# EAGLE schematic control_board (EAGLE 9.6.2)

## Sheet 1 of 4: ADC
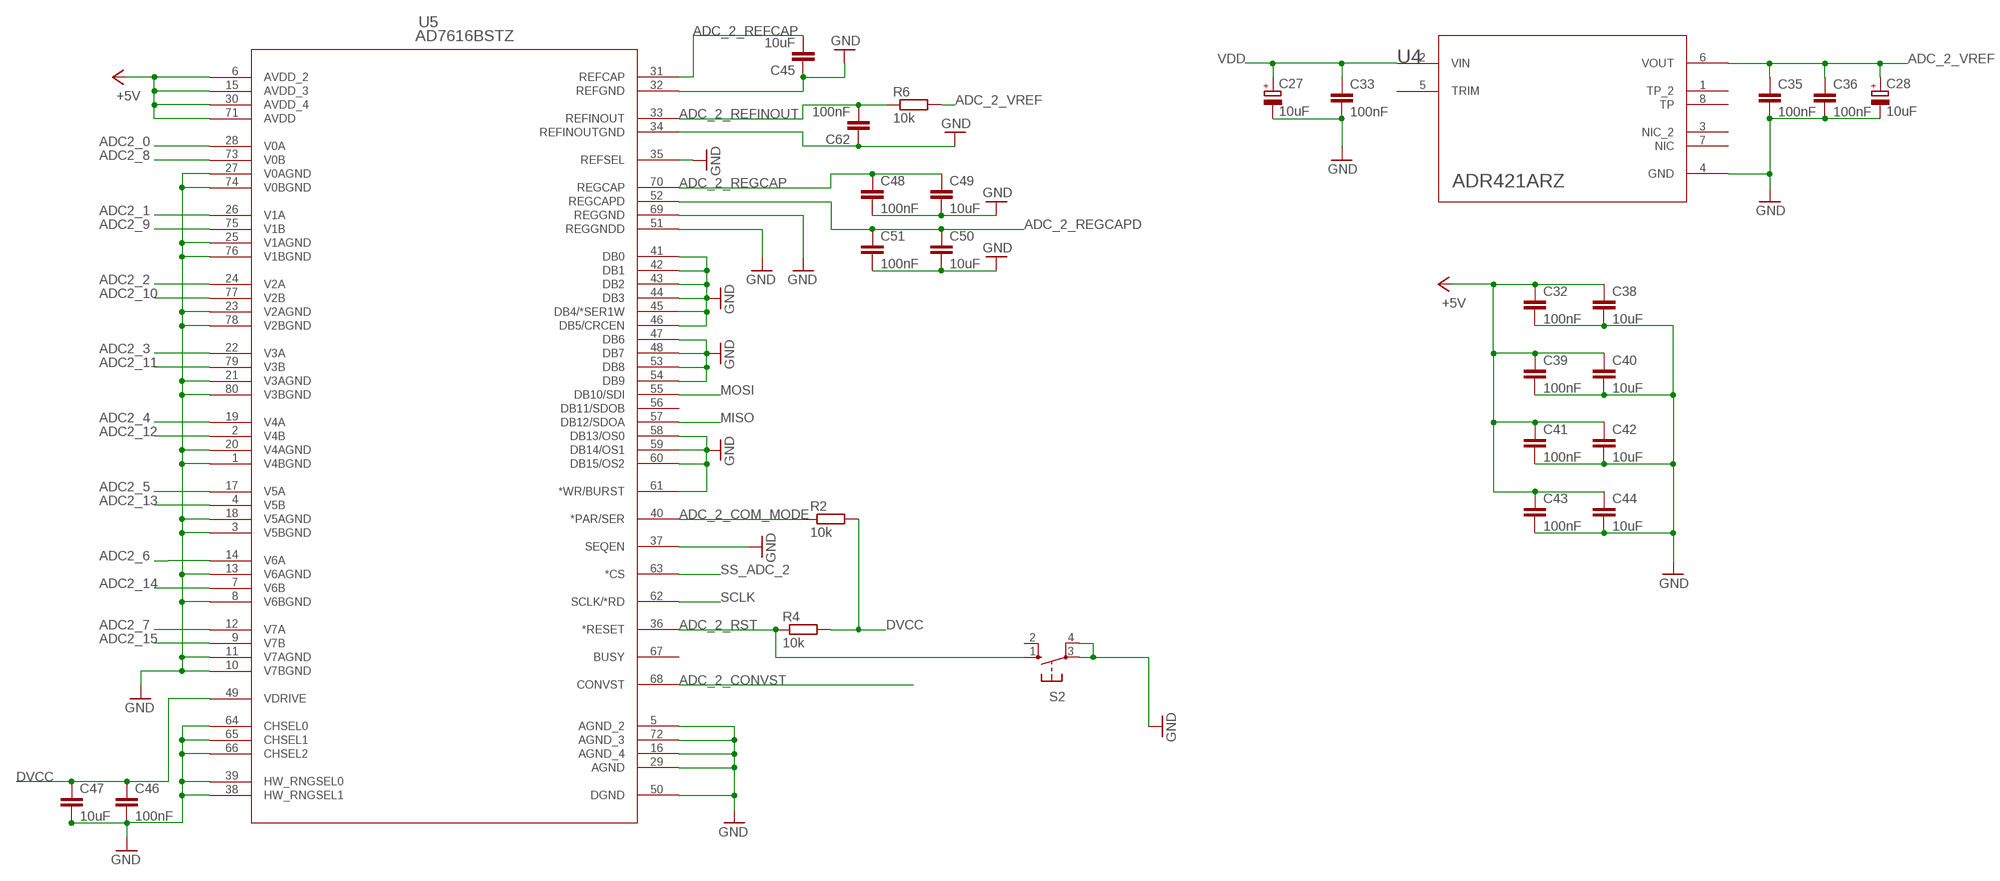
[diagram p0: schematic, sheet 1]

### Parts
C27  10uF  CPOL-EUSMCA  [SMC_A]
C28  10uF  CPOL-EUSMCA  [SMC_A]
C32  100nF  C-EUC0603  [C0603]
C33  100nF  C-EUC0603  [C0603]
C35  100nF  C-EUC0603  [C0603]
C36  100nF  C-EUC0603  [C0603]
C38  10uF  C-EUC0603  [C0603]
C39  100nF  C-EUC0603  [C0603]
C40  10uF  C-EUC0603  [C0603]
C41  100nF  C-EUC0603  [C0603]
C42  10uF  C-EUC0603  [C0603]
C43  100nF  C-EUC0603  [C0603]
C44  10uF  C-EUC0603  [C0603]
C45  10uF  C-EUC0603  [C0603]
C46  100nF  C-EUC0603  [C0603]
C47  10uF  C-EUC0603  [C0603]
C48  100nF  C-EUC0603  [C0603]
C49  10uF  C-EUC0603  [C0603]
C50  10uF  C-EUC0603  [C0603]
C51  100nF  C-EUC0603  [C0603]
C62  100nF  C-EUC0603  [C0603]
R2  10k  R-EU_R0603  [R0603]
R4  10k  R-EU_R0603  [R0603]
R6  10k  R-EU_R0603  [R0603]
S2  10-XX  [B3F-10XX]
U4  ADR421ARZ  ADR423ARZ  [R_8]
U5  AD7616BSTZ  [ST_80_2]

### Nets
+5V: C32.1 C38.1 C39.1 C40.1 C41.1 C42.1 C43.1 C44.1 U5.6(AVDD_2) U5.15(AVDD_3) U5.30(AVDD_4) U5.71(AVDD) ; also sheet 3,4
ADC2_0: U5.28(V0A) ; also sheet 4
ADC2_1: U5.26(V1A) ; also sheet 4
ADC2_2: U5.24(V2A) ; also sheet 4
ADC2_3: U5.22(V3A) ; also sheet 4
ADC2_4: U5.19(V4A) ; also sheet 4
ADC2_5: U5.17(V5A) ; also sheet 4
ADC2_6: U5.14(V6A) ; also sheet 4
ADC2_7: U5.12(V7A) ; also sheet 4
ADC2_8: U5.73(V0B) ; also sheet 4
ADC2_9: U5.75(V1B) ; also sheet 4
ADC2_10: U5.77(V2B) ; also sheet 4
ADC2_11: U5.79(V3B) ; also sheet 4
ADC2_12: U5.2(V4B) ; also sheet 4
ADC2_13: U5.4(V5B) ; also sheet 4
ADC2_14: U5.7(V6B) ; also sheet 4
ADC2_15: U5.9(V7B) ; also sheet 4
ADC_2_COM_MODE: R2.1 U5.40(*PAR/SER)
ADC_2_CONVST: U5.68(CONVST) ; also sheet 4
ADC_2_REFCAP: C45.2 U5.31(REFCAP)
ADC_2_REFINOUT: C62.2 R6.1 U5.33(REFINOUT)
ADC_2_REGCAP: C48.1 C49.1 U5.70(REGCAP)
ADC_2_REGCAPD: C50.1 C51.1 U5.52(REGCAPD)
ADC_2_RST: R4.1 S2.1(S) U5.36(*RESET)
ADC_2_VREF: C28.+ C35.1 C36.1 R6.2 U4.6(VOUT)
DVCC: C46.1 C47.1 R2.2 R4.2 U5.49(VDRIVE) ; also sheet 2,3,4
GND: C27.- C28.- C32.2 C33.2 C35.2 C36.2 C38.2 C39.2 C40.2 C41.2 C42.2 C43.2 C44.2 C45.1 C46.2 C47.2 C48.2 C49.2 C50.2 C51.2 C62.1 S2.3(P) S2.4(P1) U4.4(GND) U5.1(V4BGND) U5.3(V5BGND) U5.5(AGND_2) U5.8(V6BGND) U5.10(V7BGND) U5.11(V7AGND) U5.13(V6AGND) U5.16(AGND_4) U5.18(V5AGND) U5.20(V4AGND) U5.21(V3AGND) U5.23(V2AGND) U5.25(V1AGND) U5.27(V0AGND) U5.29(AGND) U5.32(REFGND) U5.34(REFINOUTGND) U5.35(REFSEL) U5.37(SEQEN) U5.38(HW_RNGSEL1) U5.39(HW_RNGSEL0) U5.41(DB0) U5.42(DB1) U5.43(DB2) U5.44(DB3) U5.45(DB4/*SER1W) U5.46(DB5/CRCEN) U5.47(DB6) U5.48(DB7) U5.50(DGND) U5.51(REGGNDD) U5.53(DB8) U5.54(DB9) U5.58(DB13/OS0) U5.59(DB14/OS1) U5.60(DB15/OS2) U5.61(*WR/BURST) U5.64(CHSEL0) U5.65(CHSEL1) U5.66(CHSEL2) U5.69(REGGND) U5.72(AGND_3) U5.74(V0BGND) U5.76(V1BGND) U5.78(V2BGND) U5.80(V3BGND) ; also sheet 2,3,4
MISO: U5.57(DB12/SDOA) ; also sheet 2,3,4
MOSI: U5.55(DB10/SDI) ; also sheet 2,3,4
SCLK: U5.62(SCLK/*RD) ; also sheet 2,3,4
SS_ADC_2: U5.63(*CS) ; also sheet 4
VDD: C27.+ C33.1 U4.2(VIN) ; also sheet 2,4
Unconnected: S2.2(S1) U4.1(TP_2) U4.3(NIC_2) U4.5(TRIM) U4.7(NIC) U4.8(TP) U5.56(DB11/SDOB) U5.67(BUSY)

## Sheet 2 of 4: DAC
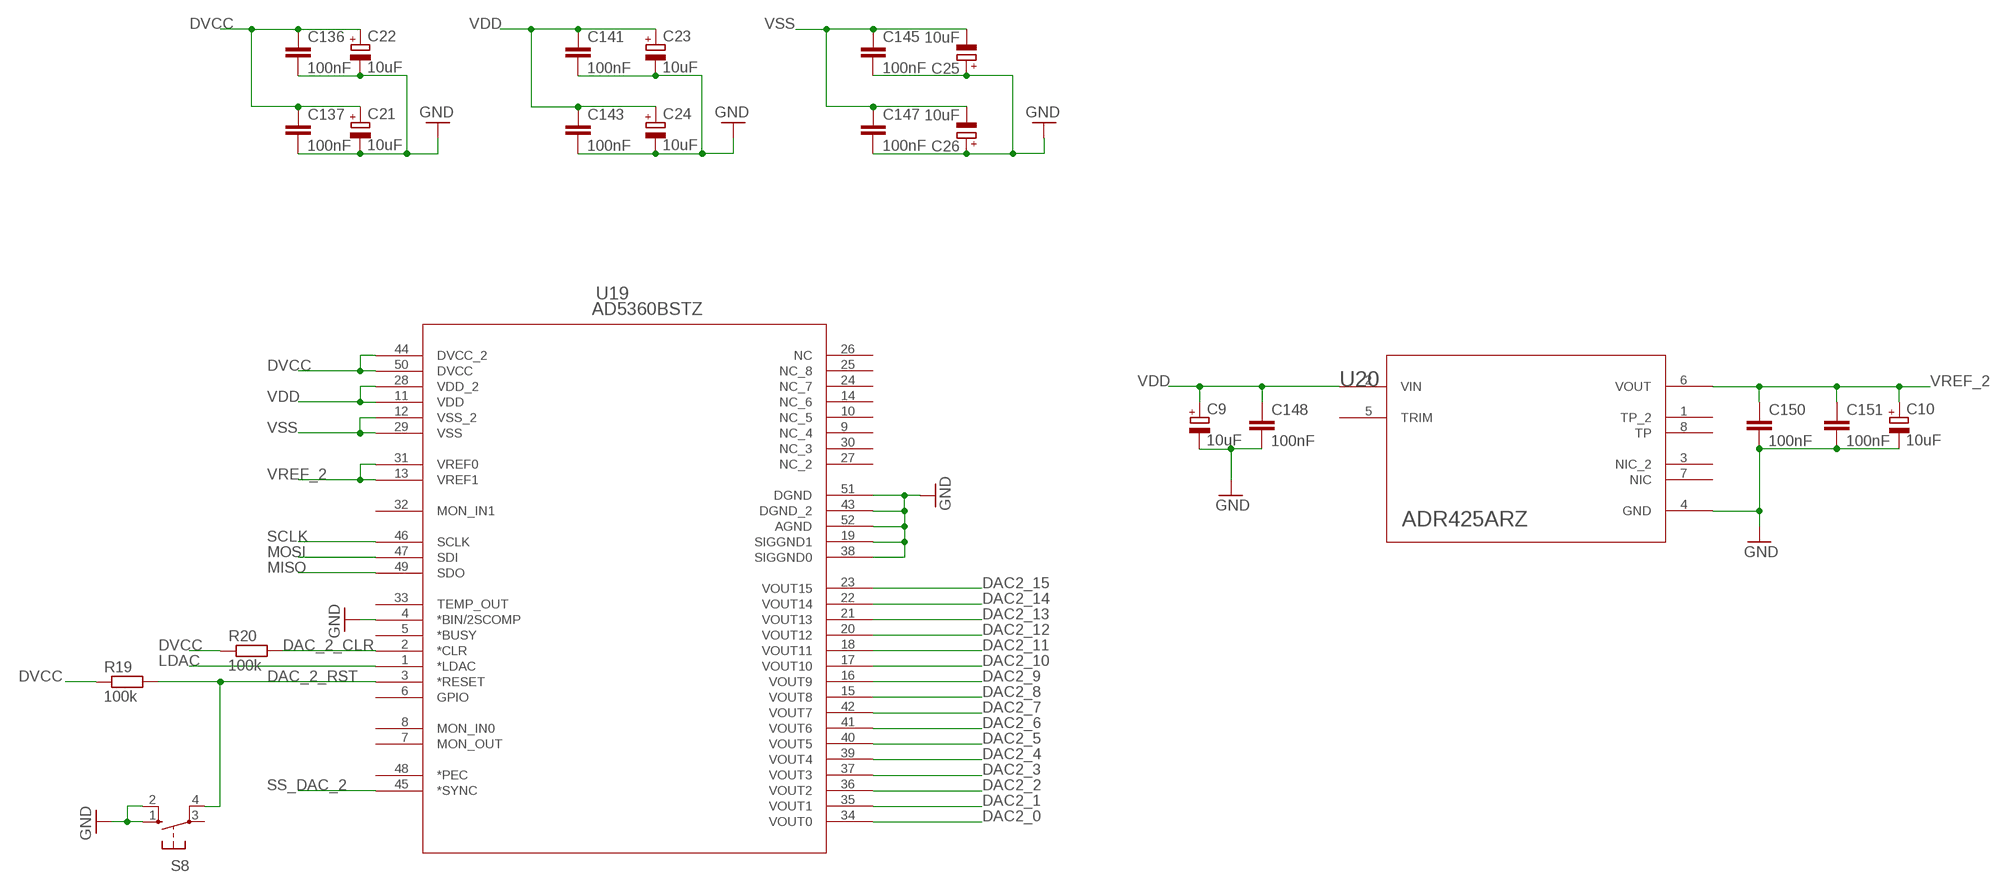
[diagram p1: schematic, sheet 2]

### Parts
C9  10uF  CPOL-EUSMCA  [SMC_A]
C10  10uF  CPOL-EUSMCA  [SMC_A]
C21  10uF  CPOL-EUSMCA  [SMC_A]
C22  10uF  CPOL-EUSMCA  [SMC_A]
C23  10uF  CPOL-EUSMCA  [SMC_A]
C24  10uF  CPOL-EUSMCA  [SMC_A]
C25  10uF  CPOL-EUSMCA  [SMC_A]
C26  10uF  CPOL-EUSMCA  [SMC_A]
C136  100nF  C-EUC0603  [C0603]
C137  100nF  C-EUC0603  [C0603]
C141  100nF  C-EUC0603  [C0603]
C143  100nF  C-EUC0603  [C0603]
C145  100nF  C-EUC0603  [C0603]
C147  100nF  C-EUC0603  [C0603]
C148  100nF  C-EUC0603  [C0603]
C150  100nF  C-EUC0603  [C0603]
C151  100nF  C-EUC0603  [C0603]
R19  100k  R-EU_R0603  [R0603]
R20  100k  R-EU_R0603  [R0603]
S8  10-XX  [B3F-10XX]
U19  AD5360BSTZ  [ST_52]
U20  ADR425ARZ  ADR423ARZ  [R_8]

### Nets
DAC2_0: U19.34(VOUT0) ; also sheet 4
DAC2_1: U19.35(VOUT1) ; also sheet 4
DAC2_2: U19.36(VOUT2) ; also sheet 4
DAC2_3: U19.37(VOUT3) ; also sheet 4
DAC2_4: U19.39(VOUT4) ; also sheet 4
DAC2_5: U19.40(VOUT5) ; also sheet 4
DAC2_6: U19.41(VOUT6) ; also sheet 4
DAC2_7: U19.42(VOUT7) ; also sheet 4
DAC2_8: U19.15(VOUT8) ; also sheet 4
DAC2_9: U19.16(VOUT9) ; also sheet 4
DAC2_10: U19.17(VOUT10) ; also sheet 4
DAC2_11: U19.18(VOUT11) ; also sheet 4
DAC2_12: U19.20(VOUT12) ; also sheet 4
DAC2_13: U19.21(VOUT13) ; also sheet 4
DAC2_14: U19.22(VOUT14) ; also sheet 4
DAC2_15: U19.23(VOUT15) ; also sheet 4
DAC_2_CLR: R20.2 U19.2(*CLR)
DAC_2_RST: R19.2 S8.4(P1) U19.3(*RESET)
DVCC: C21.+ C22.+ C136.1 C137.1 R19.1 R20.1 U19.44(DVCC_2) U19.50(DVCC) ; also sheet 1,3,4
GND: C9.- C10.- C21.- C22.- C23.- C24.- C25.+ C26.+ C136.2 C137.2 C141.2 C143.2 C145.2 C147.2 C148.2 C150.2 C151.2 S8.1(S) S8.2(S1) U19.4(*BIN/2SCOMP) U19.19(SIGGND1) U19.38(SIGGND0) U19.43(DGND_2) U19.51(DGND) U19.52(AGND) U20.4(GND) ; also sheet 1,3,4
LDAC: U19.1(*LDAC) ; also sheet 4
MISO: U19.49(SDO) ; also sheet 1,3,4
MOSI: U19.47(SDI) ; also sheet 1,3,4
SCLK: U19.46(SCLK) ; also sheet 1,3,4
SS_DAC_2: U19.45(*SYNC) ; also sheet 4
VDD: C9.+ C23.+ C24.+ C141.1 C143.1 C148.1 U19.11(VDD) U19.28(VDD_2) U20.2(VIN) ; also sheet 1,4
VREF_2: C10.+ C150.1 C151.1 U19.13(VREF1) U19.31(VREF0) U20.6(VOUT)
VSS: C25.- C26.- C145.1 C147.1 U19.12(VSS_2) U19.29(VSS) ; also sheet 4
Unconnected: S8.3(P) U19.5(*BUSY) U19.6(GPIO) U19.7(MON_OUT) U19.8(MON_IN0) U19.9(NC_4) U19.10(NC_5) U19.14(NC_6) U19.24(NC_7) U19.25(NC_8) U19.26(NC) U19.27(NC_2) U19.30(NC_3) U19.32(MON_IN1) U19.33(TEMP_OUT) U19.48(*PEC) U20.1(TP_2) U20.3(NIC_2) U20.5(TRIM) U20.7(NIC) U20.8(TP)

## Sheet 3 of 4: LoadCell
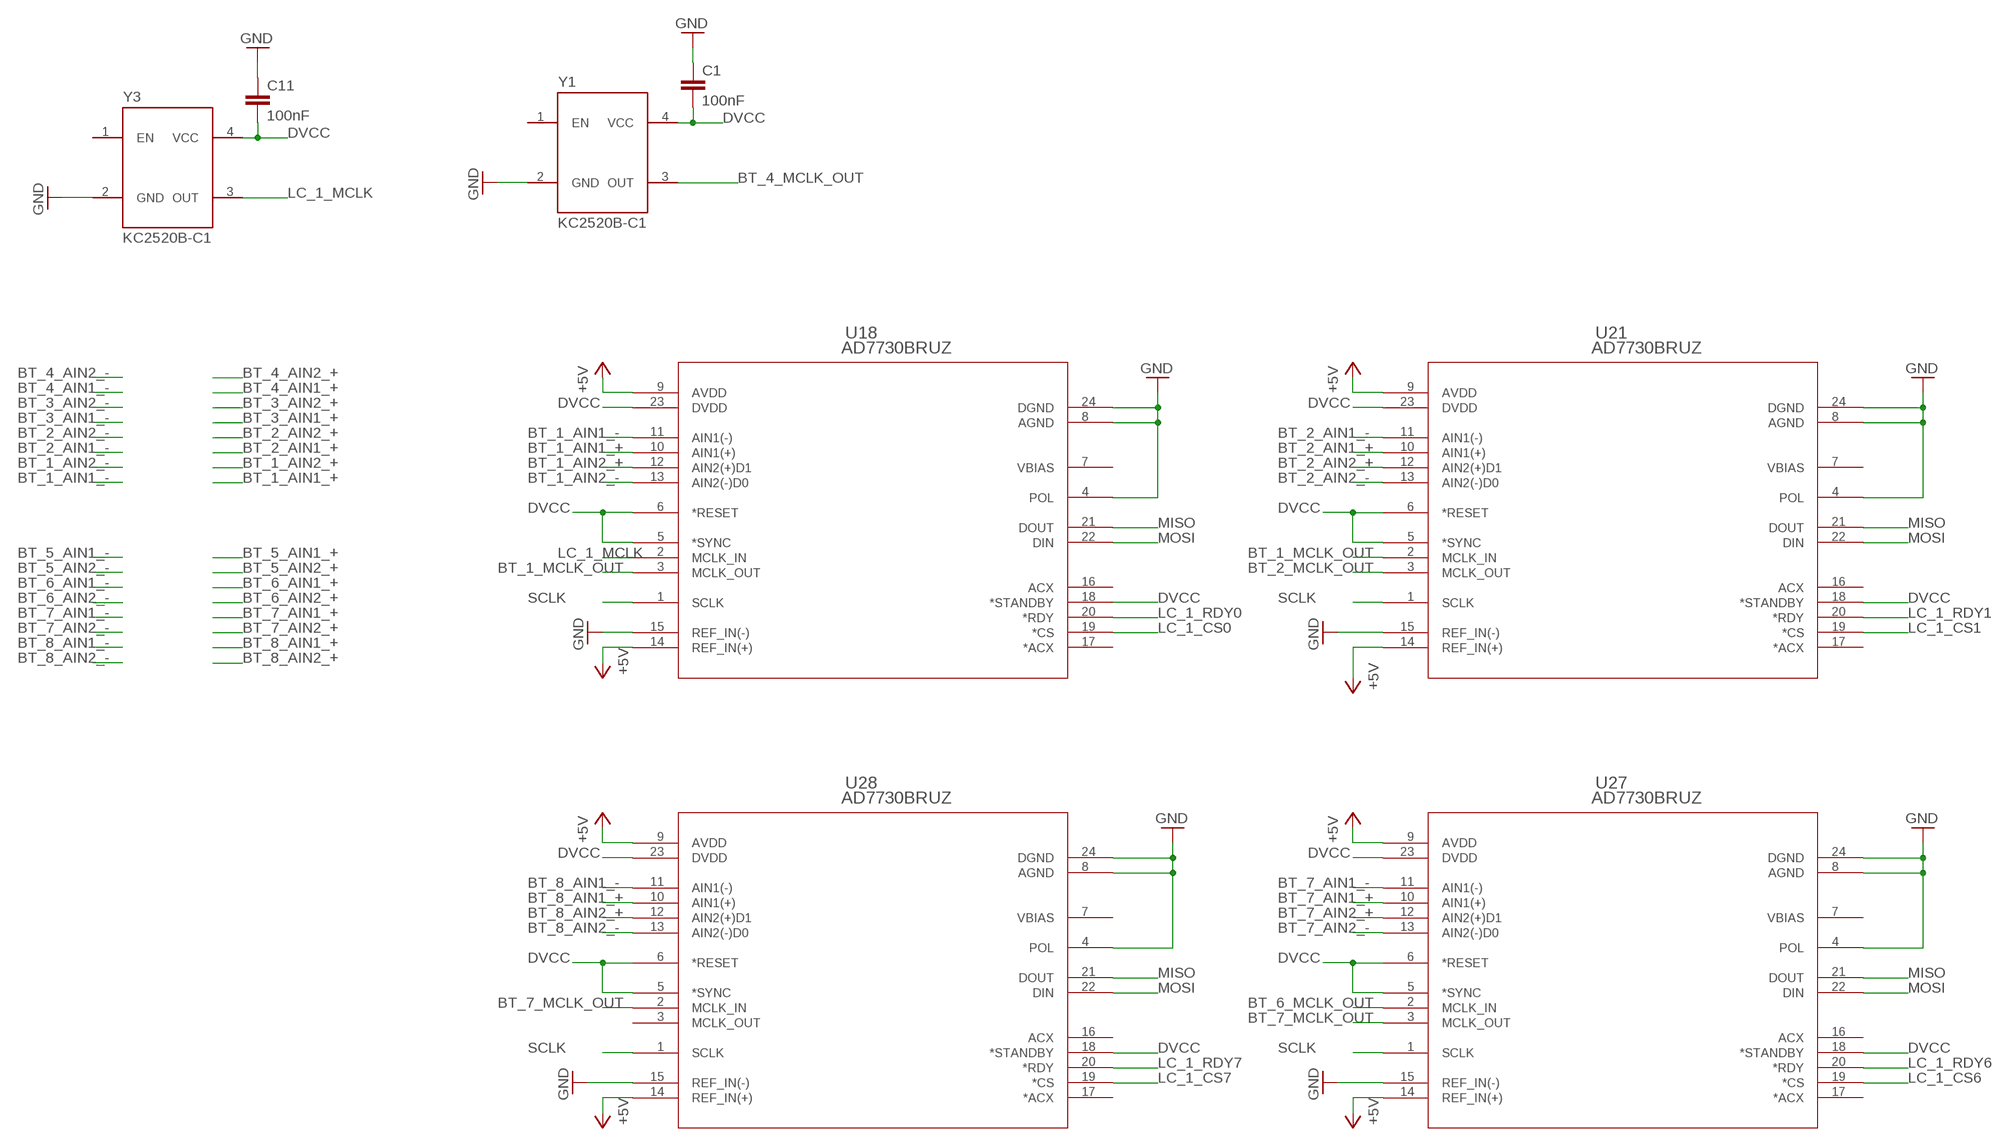
[diagram p2: schematic, sheet 3, part 1 of 2]
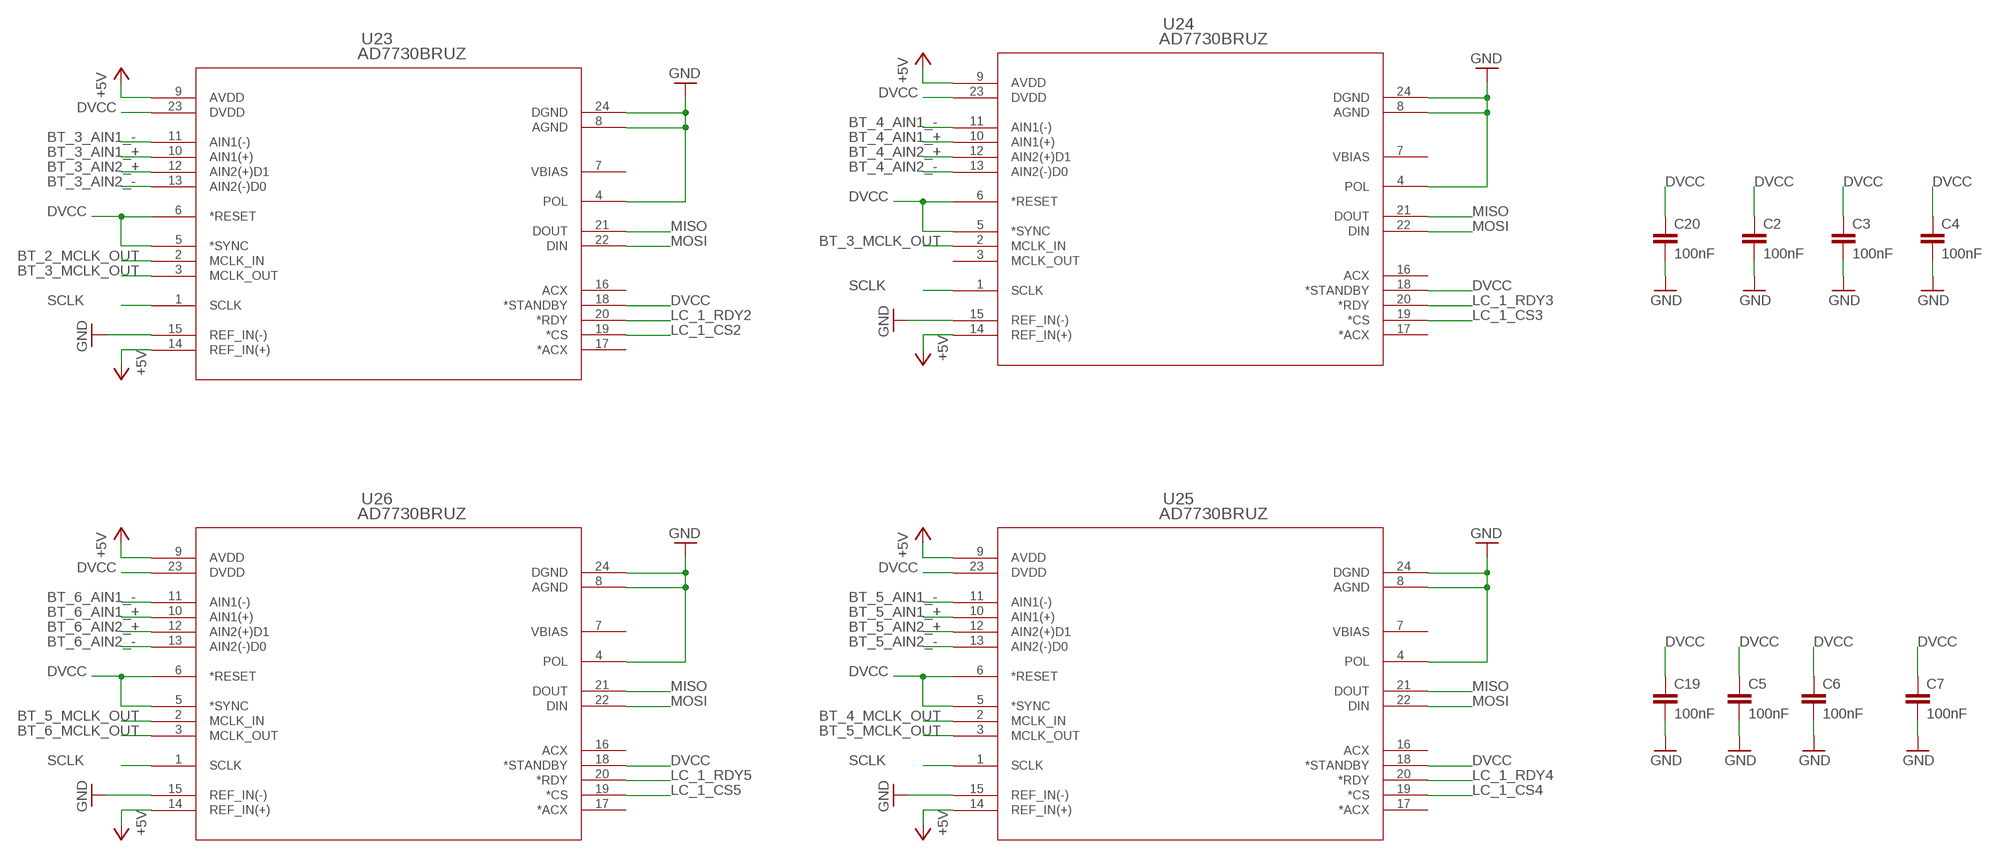
[diagram p3: schematic, sheet 3, part 2 of 2]

### Parts
C1  100nF  C-EUC0603  [C0603]
C2  100nF  C-EUC0603  [C0603]
C3  100nF  C-EUC0603  [C0603]
C4  100nF  C-EUC0603  [C0603]
C5  100nF  C-EUC0603  [C0603]
C6  100nF  C-EUC0603  [C0603]
C7  100nF  C-EUC0603  [C0603]
C11  100nF  C-EUC0603  [C0603]
C19  100nF  C-EUC0603  [C0603]
C20  100nF  C-EUC0603  [C0603]
U18  AD7730BRUZ  [RU_24]
U21  AD7730BRUZ  [RU_24]
U23  AD7730BRUZ  [RU_24]
U24  AD7730BRUZ  [RU_24]
U25  AD7730BRUZ  [RU_24]
U26  AD7730BRUZ  [RU_24]
U27  AD7730BRUZ  [RU_24]
U28  AD7730BRUZ  [RU_24]
Y1  KC2520B-C1  [KC2520B-C1]
Y3  KC2520B-C1  [KC2520B-C1]

### Nets
+5V: U18.9(AVDD) U18.14(REF_IN(+)) U21.9(AVDD) U21.14(REF_IN(+)) U23.9(AVDD) U23.14(REF_IN(+)) U24.9(AVDD) U24.14(REF_IN(+)) U25.9(AVDD) U25.14(REF_IN(+)) U26.9(AVDD) U26.14(REF_IN(+)) U27.9(AVDD) U27.14(REF_IN(+)) U28.9(AVDD) U28.14(REF_IN(+)) ; also sheet 1,4
BT_1_AIN1_+: U18.10(AIN1(+)) ; also sheet 4
BT_1_AIN1_-: U18.11(AIN1(-)) ; also sheet 4
BT_1_AIN2_+: U18.12(AIN2(+)D1) ; also sheet 4
BT_1_AIN2_-: U18.13(AIN2(-)D0) ; also sheet 4
BT_1_MCLK_OUT: U18.3(MCLK_OUT) U21.2(MCLK_IN)
BT_2_AIN1_+: U21.10(AIN1(+)) ; also sheet 4
BT_2_AIN1_-: U21.11(AIN1(-)) ; also sheet 4
BT_2_AIN2_+: U21.12(AIN2(+)D1) ; also sheet 4
BT_2_AIN2_-: U21.13(AIN2(-)D0) ; also sheet 4
BT_2_MCLK_OUT: U21.3(MCLK_OUT) U23.2(MCLK_IN)
BT_3_AIN1_+: U23.10(AIN1(+)) ; also sheet 4
BT_3_AIN1_-: U23.11(AIN1(-)) ; also sheet 4
BT_3_AIN2_+: U23.12(AIN2(+)D1) ; also sheet 4
BT_3_AIN2_-: U23.13(AIN2(-)D0) ; also sheet 4
BT_3_MCLK_OUT: U23.3(MCLK_OUT) U24.2(MCLK_IN)
BT_4_AIN1_+: U24.10(AIN1(+)) ; also sheet 4
BT_4_AIN1_-: U24.11(AIN1(-)) ; also sheet 4
BT_4_AIN2_+: U24.12(AIN2(+)D1) ; also sheet 4
BT_4_AIN2_-: U24.13(AIN2(-)D0) ; also sheet 4
BT_4_MCLK_OUT: U25.2(MCLK_IN) Y1.3(OUT)
BT_5_AIN1_+: U25.10(AIN1(+)) ; also sheet 4
BT_5_AIN1_-: U25.11(AIN1(-)) ; also sheet 4
BT_5_AIN2_+: U25.12(AIN2(+)D1) ; also sheet 4
BT_5_AIN2_-: U25.13(AIN2(-)D0) ; also sheet 4
BT_5_MCLK_OUT: U25.3(MCLK_OUT) U26.2(MCLK_IN)
BT_6_AIN1_+: U26.10(AIN1(+)) ; also sheet 4
BT_6_AIN1_-: U26.11(AIN1(-)) ; also sheet 4
BT_6_AIN2_+: U26.12(AIN2(+)D1) ; also sheet 4
BT_6_AIN2_-: U26.13(AIN2(-)D0) ; also sheet 4
BT_6_MCLK_OUT: U26.3(MCLK_OUT) U27.2(MCLK_IN)
BT_7_AIN1_+: U27.10(AIN1(+)) ; also sheet 4
BT_7_AIN1_-: U27.11(AIN1(-)) ; also sheet 4
BT_7_AIN2_+: U27.12(AIN2(+)D1) ; also sheet 4
BT_7_AIN2_-: U27.13(AIN2(-)D0) ; also sheet 4
BT_7_MCLK_OUT: U27.3(MCLK_OUT) U28.2(MCLK_IN)
BT_8_AIN1_+: U28.10(AIN1(+)) ; also sheet 4
BT_8_AIN1_-: U28.11(AIN1(-)) ; also sheet 4
BT_8_AIN2_+: U28.12(AIN2(+)D1) ; also sheet 4
BT_8_AIN2_-: U28.13(AIN2(-)D0) ; also sheet 4
DVCC: C1.2 C2.1 C3.1 C4.1 C5.1 C6.1 C7.1 C11.2 C19.1 C20.1 U18.5(*SYNC) U18.6(*RESET) U18.18(*STANDBY) U18.23(DVDD) U21.5(*SYNC) U21.6(*RESET) U21.18(*STANDBY) U21.23(DVDD) U23.5(*SYNC) U23.6(*RESET) U23.18(*STANDBY) U23.23(DVDD) U24.5(*SYNC) U24.6(*RESET) U24.18(*STANDBY) U24.23(DVDD) U25.5(*SYNC) U25.6(*RESET) U25.18(*STANDBY) U25.23(DVDD) U26.5(*SYNC) U26.6(*RESET) U26.18(*STANDBY) U26.23(DVDD) U27.5(*SYNC) U27.6(*RESET) U27.18(*STANDBY) U27.23(DVDD) U28.5(*SYNC) U28.6(*RESET) U28.18(*STANDBY) U28.23(DVDD) Y1.4(VCC) Y3.4(VCC) ; also sheet 1,2,4
GND: C1.1 C2.2 C3.2 C4.2 C5.2 C6.2 C7.2 C11.1 C19.2 C20.2 U18.4(POL) U18.8(AGND) U18.15(REF_IN(-)) U18.24(DGND) U21.4(POL) U21.8(AGND) U21.15(REF_IN(-)) U21.24(DGND) U23.4(POL) U23.8(AGND) U23.15(REF_IN(-)) U23.24(DGND) U24.4(POL) U24.8(AGND) U24.15(REF_IN(-)) U24.24(DGND) U25.4(POL) U25.8(AGND) U25.15(REF_IN(-)) U25.24(DGND) U26.4(POL) U26.8(AGND) U26.15(REF_IN(-)) U26.24(DGND) U27.4(POL) U27.8(AGND) U27.15(REF_IN(-)) U27.24(DGND) U28.4(POL) U28.8(AGND) U28.15(REF_IN(-)) U28.24(DGND) Y1.2(GND) Y3.2(GND) ; also sheet 1,2,4
LC_1_CS0: U18.19(*CS) ; also sheet 4
LC_1_CS1: U21.19(*CS) ; also sheet 4
LC_1_CS2: U23.19(*CS) ; also sheet 4
LC_1_CS3: U24.19(*CS) ; also sheet 4
LC_1_CS4: U25.19(*CS) ; also sheet 4
LC_1_CS5: U26.19(*CS) ; also sheet 4
LC_1_CS6: U27.19(*CS) ; also sheet 4
LC_1_CS7: U28.19(*CS) ; also sheet 4
LC_1_MCLK: U18.2(MCLK_IN) Y3.3(OUT)
LC_1_RDY0: U18.20(*RDY) ; also sheet 4
LC_1_RDY1: U21.20(*RDY) ; also sheet 4
LC_1_RDY2: U23.20(*RDY) ; also sheet 4
LC_1_RDY3: U24.20(*RDY) ; also sheet 4
LC_1_RDY4: U25.20(*RDY) ; also sheet 4
LC_1_RDY5: U26.20(*RDY) ; also sheet 4
LC_1_RDY6: U27.20(*RDY) ; also sheet 4
LC_1_RDY7: U28.20(*RDY) ; also sheet 4
MISO: U18.21(DOUT) U21.21(DOUT) U23.21(DOUT) U24.21(DOUT) U25.21(DOUT) U26.21(DOUT) U27.21(DOUT) U28.21(DOUT) ; also sheet 1,2,4
MOSI: U18.22(DIN) U21.22(DIN) U23.22(DIN) U24.22(DIN) U25.22(DIN) U26.22(DIN) U27.22(DIN) U28.22(DIN) ; also sheet 1,2,4
SCLK: U18.1(SCLK) U21.1(SCLK) U23.1(SCLK) U24.1(SCLK) U25.1(SCLK) U26.1(SCLK) U27.1(SCLK) U28.1(SCLK) ; also sheet 1,2,4
Unconnected: U18.7(VBIAS) U18.16(ACX) U18.17(*ACX) U21.7(VBIAS) U21.16(ACX) U21.17(*ACX) U23.7(VBIAS) U23.16(ACX) U23.17(*ACX) U24.3(MCLK_OUT) U24.7(VBIAS) U24.16(ACX) U24.17(*ACX) U25.7(VBIAS) U25.16(ACX) U25.17(*ACX) U26.7(VBIAS) U26.16(ACX) U26.17(*ACX) U27.7(VBIAS) U27.16(ACX) U27.17(*ACX) U28.3(MCLK_OUT) U28.7(VBIAS) U28.16(ACX) U28.17(*ACX) Y1.1(EN) Y3.1(EN)

## Sheet 4 of 4: Connectors
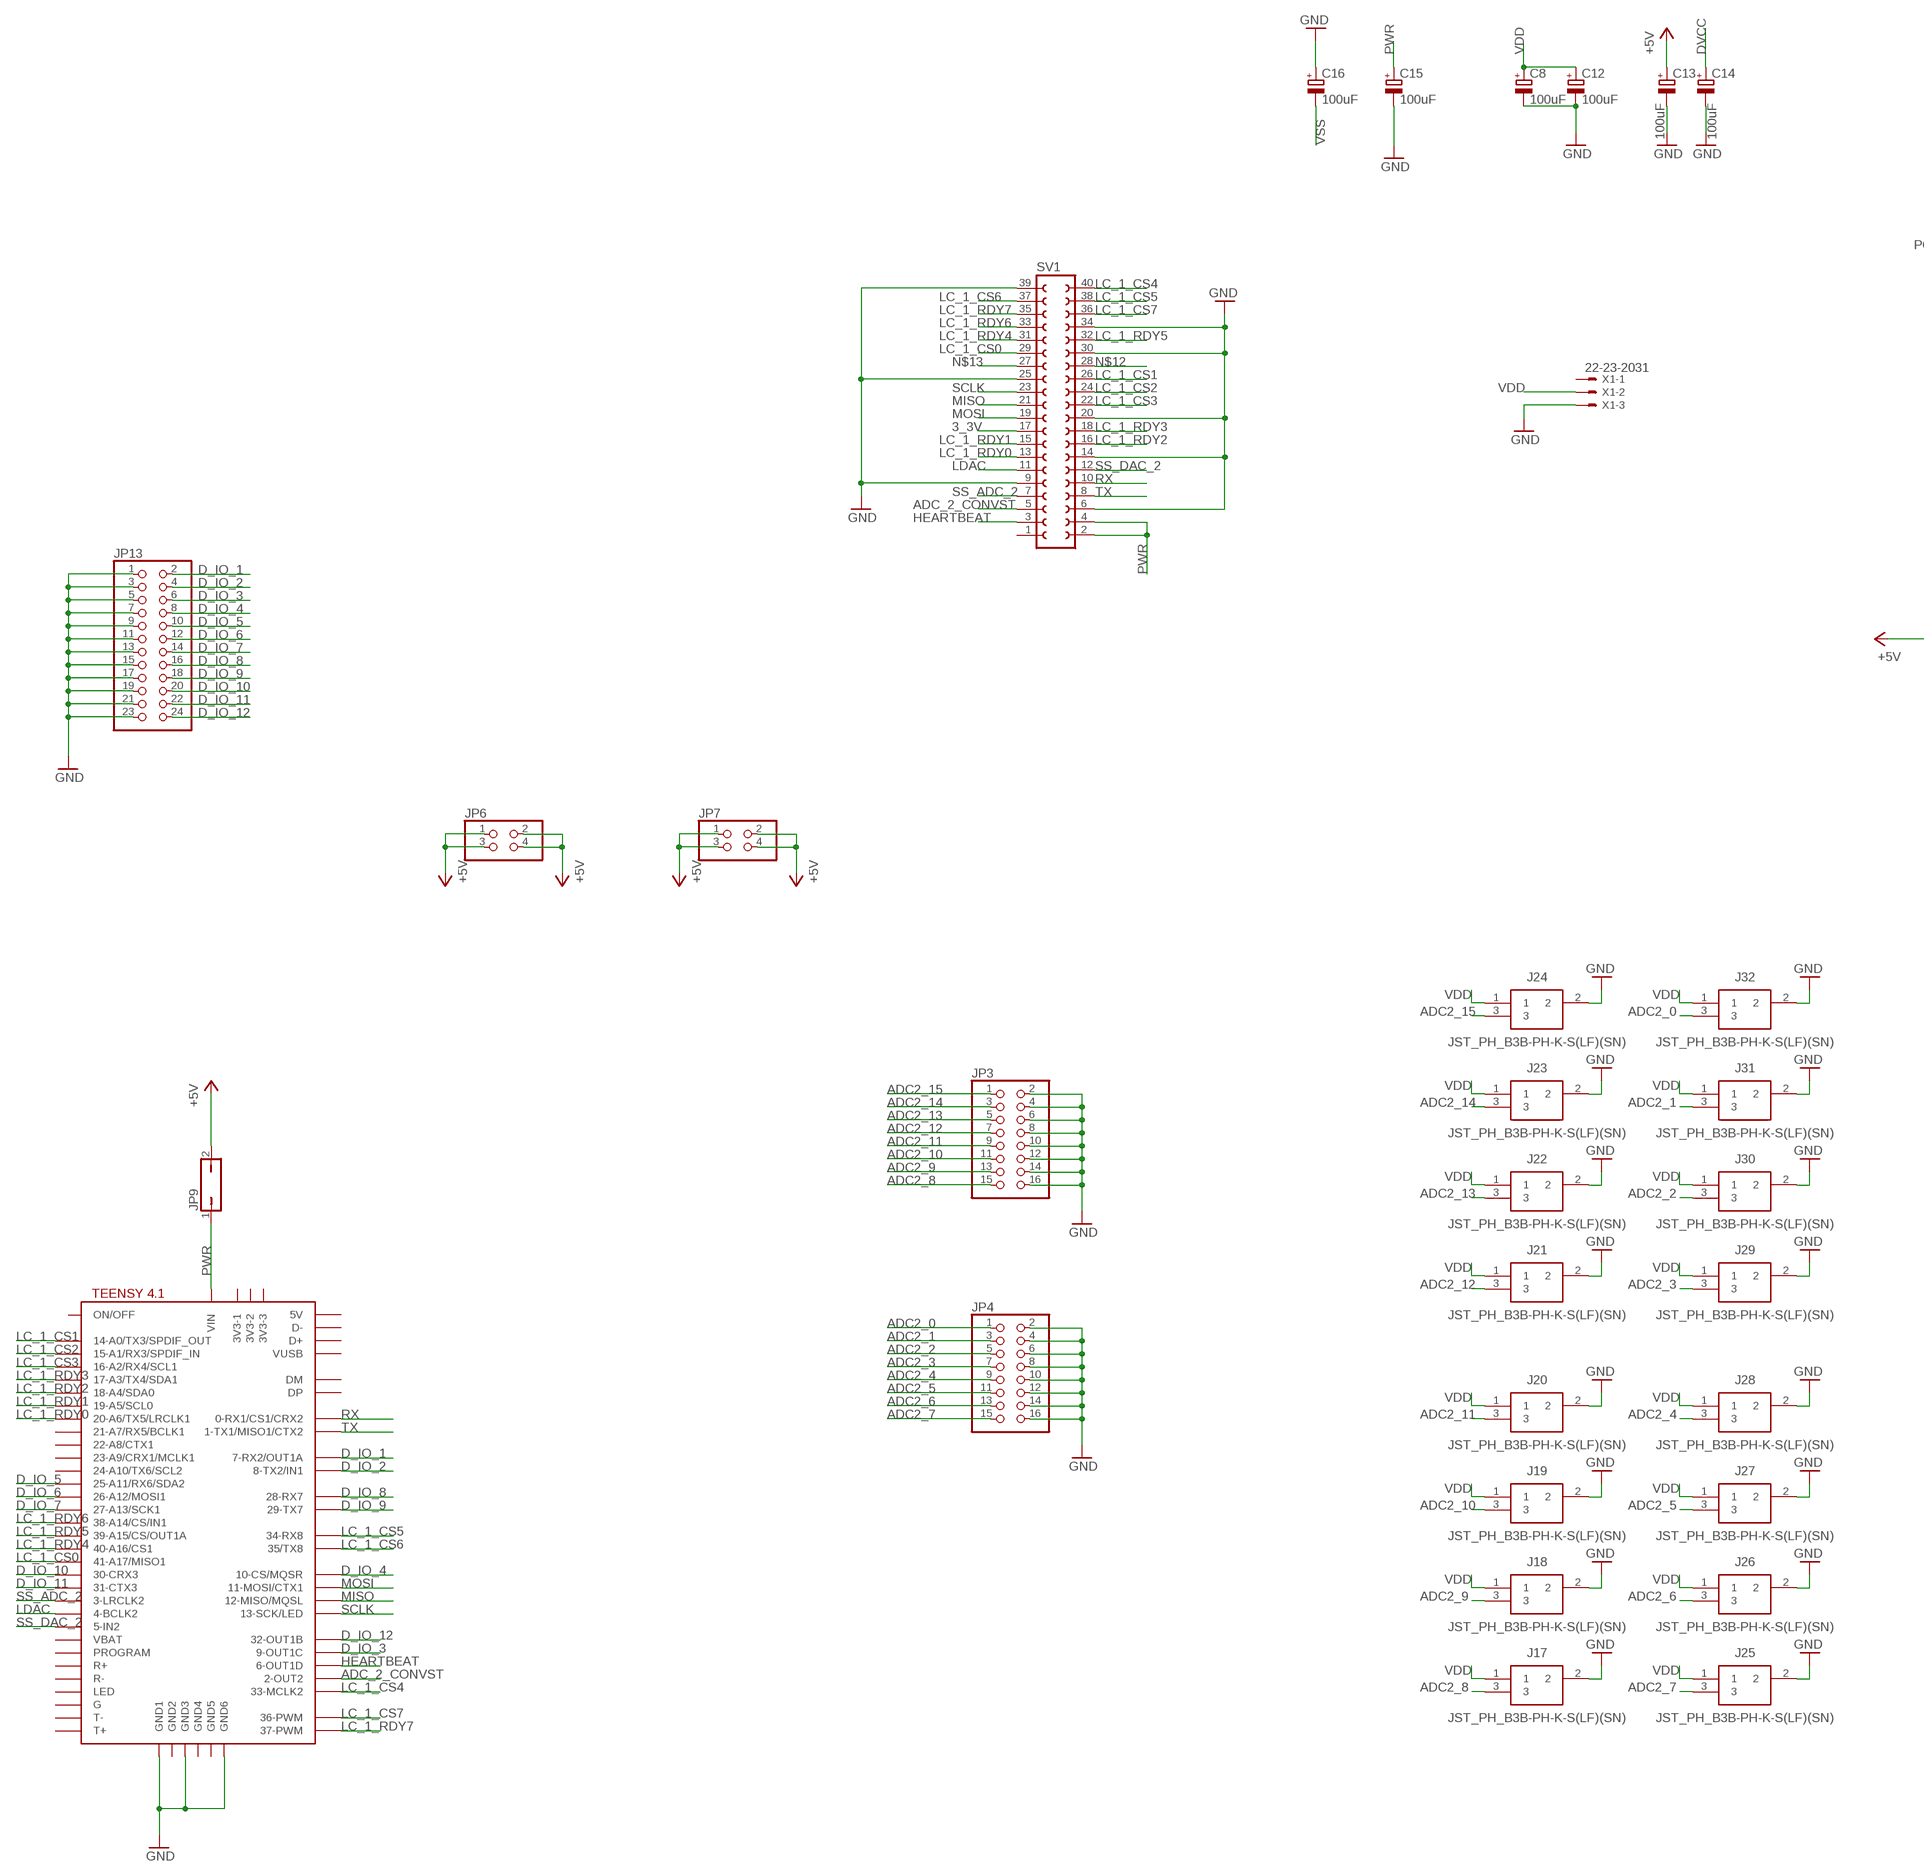
[diagram p4: schematic, sheet 4, part 1 of 2]
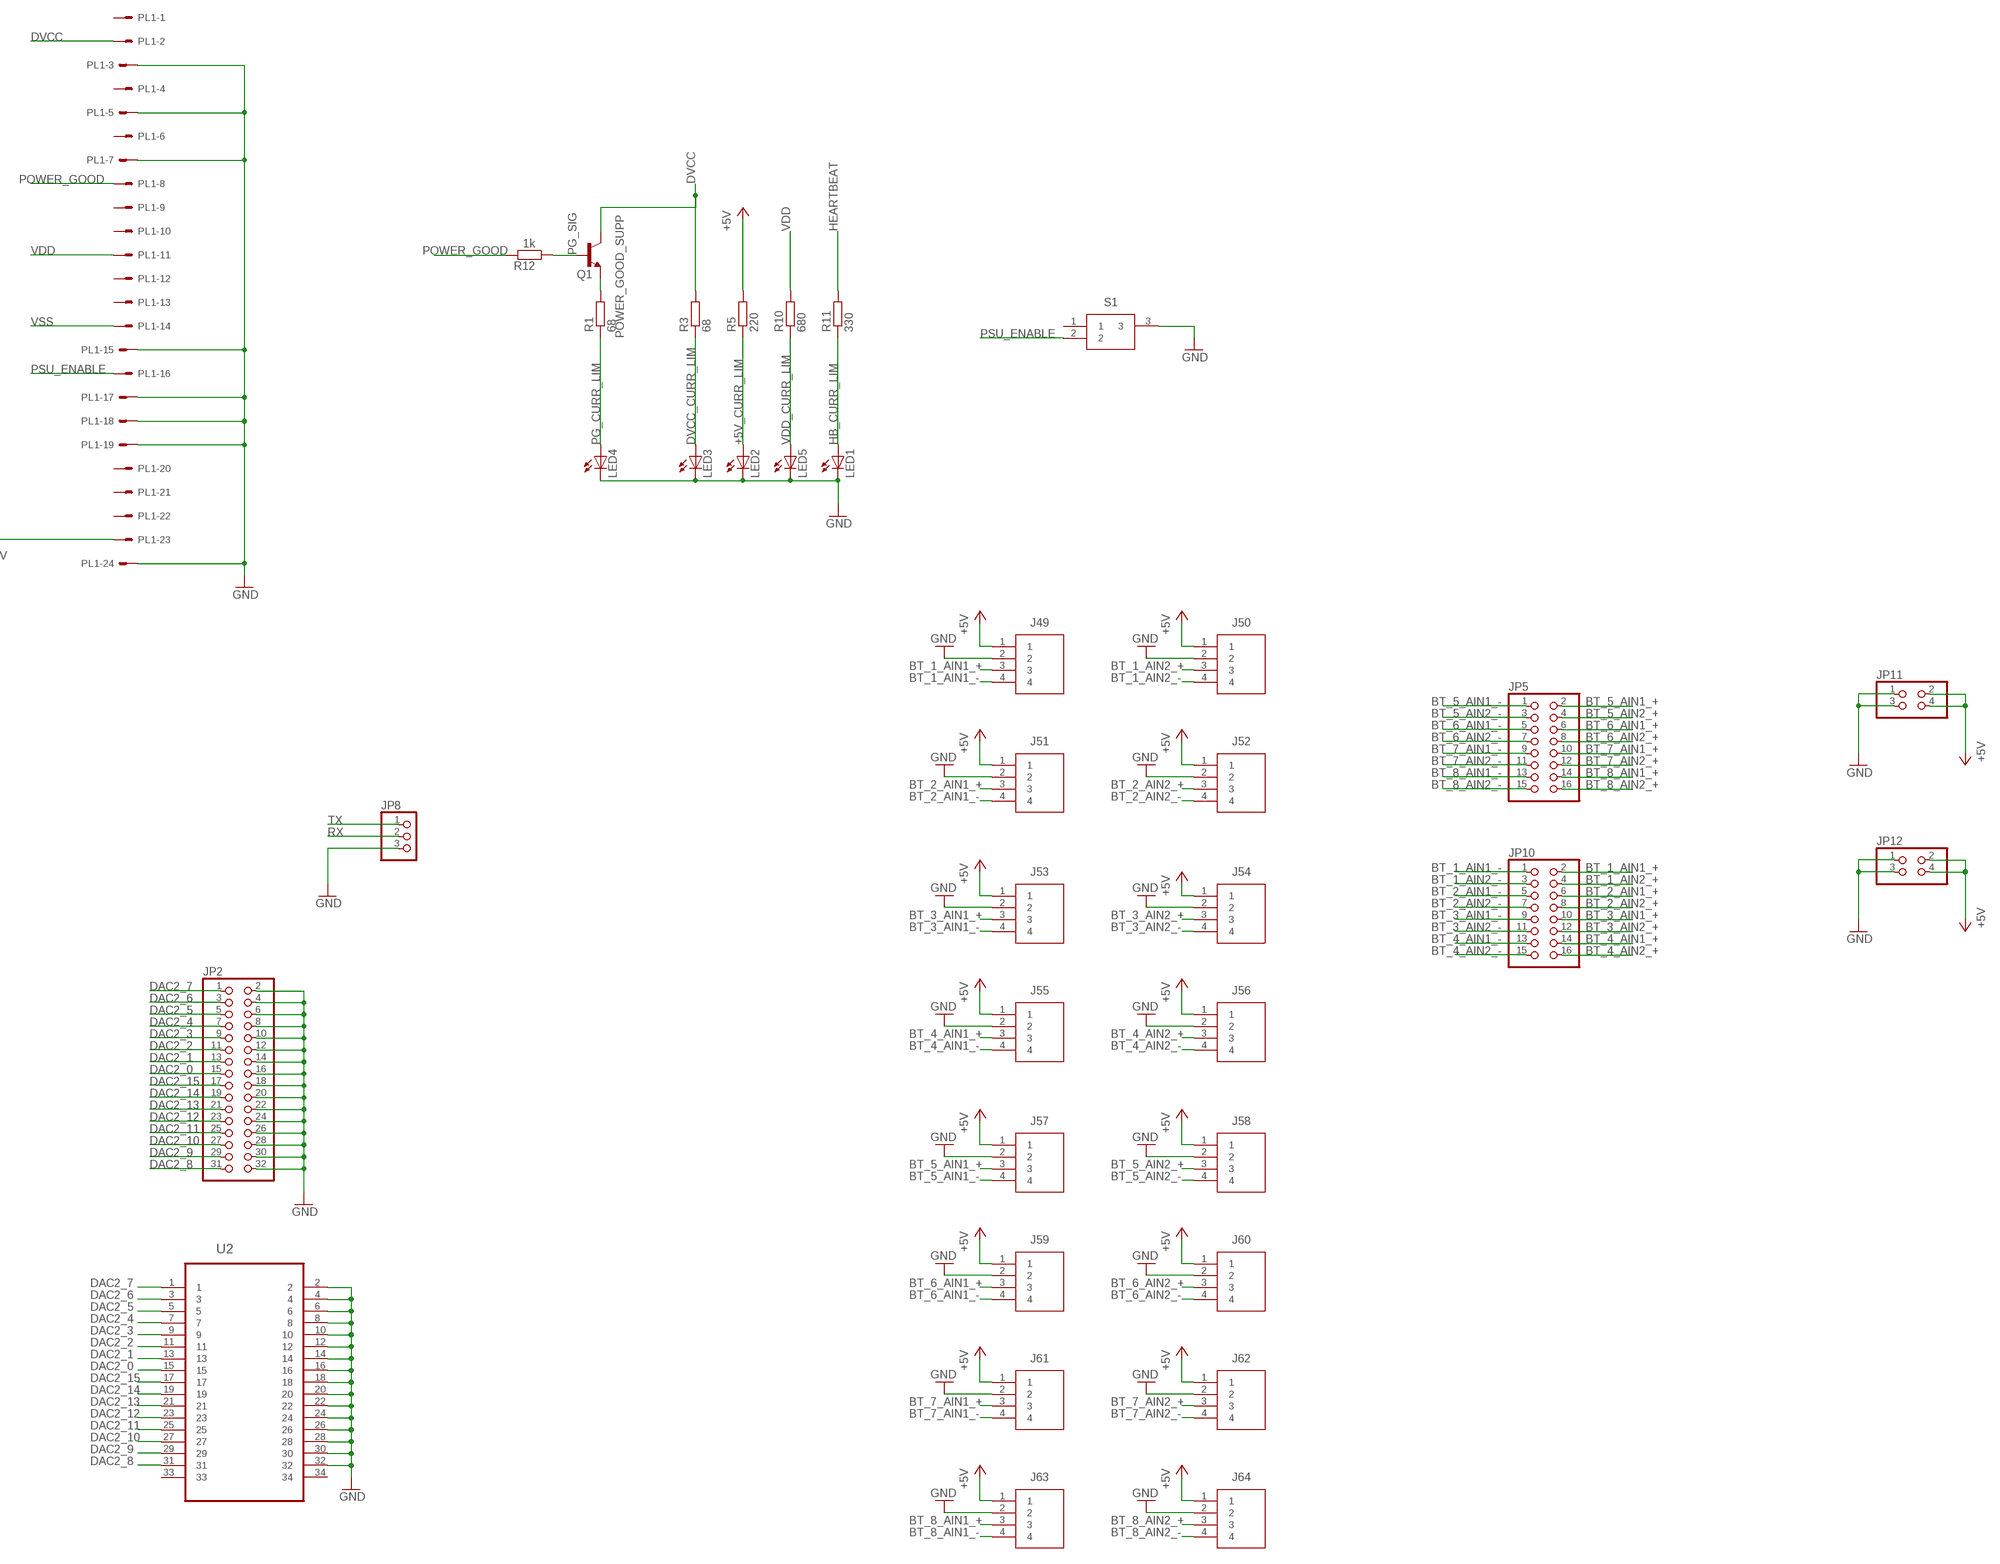
[diagram p5: schematic, sheet 4, part 2 of 2]

### Parts
C8  100uF  CPOL-EUE3.5-8  [E3,5-8]
C12  100uF  CPOL-EUE3.5-8  [E3,5-8]
C13  100uF  CPOL-EUE3.5-8  [E3,5-8]
C14  100uF  CPOL-EUE3.5-8  [E3,5-8]
C15  100uF  CPOL-EUE3.5-8  [E3,5-8]
C16  100uF  CPOL-EUE3.5-8  [E3,5-8]
J17  JST_PH_B3B-PH-K-S(LF)(SN)  [JST_PH_SHDR3W50P0X200_1X3_790X450X600]
J18  JST_PH_B3B-PH-K-S(LF)(SN)  [JST_PH_SHDR3W50P0X200_1X3_790X450X600]
J19  JST_PH_B3B-PH-K-S(LF)(SN)  [JST_PH_SHDR3W50P0X200_1X3_790X450X600]
J20  JST_PH_B3B-PH-K-S(LF)(SN)  [JST_PH_SHDR3W50P0X200_1X3_790X450X600]
J21  JST_PH_B3B-PH-K-S(LF)(SN)  [JST_PH_SHDR3W50P0X200_1X3_790X450X600]
J22  JST_PH_B3B-PH-K-S(LF)(SN)  [JST_PH_SHDR3W50P0X200_1X3_790X450X600]
J23  JST_PH_B3B-PH-K-S(LF)(SN)  [JST_PH_SHDR3W50P0X200_1X3_790X450X600]
J24  JST_PH_B3B-PH-K-S(LF)(SN)  [JST_PH_SHDR3W50P0X200_1X3_790X450X600]
J25  JST_PH_B3B-PH-K-S(LF)(SN)  [JST_PH_SHDR3W50P0X200_1X3_790X450X600]
J26  JST_PH_B3B-PH-K-S(LF)(SN)  [JST_PH_SHDR3W50P0X200_1X3_790X450X600]
J27  JST_PH_B3B-PH-K-S(LF)(SN)  [JST_PH_SHDR3W50P0X200_1X3_790X450X600]
J28  JST_PH_B3B-PH-K-S(LF)(SN)  [JST_PH_SHDR3W50P0X200_1X3_790X450X600]
J29  JST_PH_B3B-PH-K-S(LF)(SN)  [JST_PH_SHDR3W50P0X200_1X3_790X450X600]
J30  JST_PH_B3B-PH-K-S(LF)(SN)  [JST_PH_SHDR3W50P0X200_1X3_790X450X600]
J31  JST_PH_B3B-PH-K-S(LF)(SN)  [JST_PH_SHDR3W50P0X200_1X3_790X450X600]
J32  JST_PH_B3B-PH-K-S(LF)(SN)  [JST_PH_SHDR3W50P0X200_1X3_790X450X600]
J49  B4B-PH-K-S(LF)(SN)  [SHDR4W50P0X200_1X4_990X450X600]
J50  B4B-PH-K-S(LF)(SN)  [SHDR4W50P0X200_1X4_990X450X600]
J51  B4B-PH-K-S(LF)(SN)  [SHDR4W50P0X200_1X4_990X450X600]
J52  B4B-PH-K-S(LF)(SN)  [SHDR4W50P0X200_1X4_990X450X600]
J53  B4B-PH-K-S(LF)(SN)  [SHDR4W50P0X200_1X4_990X450X600]
J54  B4B-PH-K-S(LF)(SN)  [SHDR4W50P0X200_1X4_990X450X600]
J55  B4B-PH-K-S(LF)(SN)  [SHDR4W50P0X200_1X4_990X450X600]
J56  B4B-PH-K-S(LF)(SN)  [SHDR4W50P0X200_1X4_990X450X600]
J57  B4B-PH-K-S(LF)(SN)  [SHDR4W50P0X200_1X4_990X450X600]
J58  B4B-PH-K-S(LF)(SN)  [SHDR4W50P0X200_1X4_990X450X600]
J59  B4B-PH-K-S(LF)(SN)  [SHDR4W50P0X200_1X4_990X450X600]
J60  B4B-PH-K-S(LF)(SN)  [SHDR4W50P0X200_1X4_990X450X600]
J61  B4B-PH-K-S(LF)(SN)  [SHDR4W50P0X200_1X4_990X450X600]
J62  B4B-PH-K-S(LF)(SN)  [SHDR4W50P0X200_1X4_990X450X600]
J63  B4B-PH-K-S(LF)(SN)  [SHDR4W50P0X200_1X4_990X450X600]
J64  B4B-PH-K-S(LF)(SN)  [SHDR4W50P0X200_1X4_990X450X600]
JP2  PINHD-2X16/90  [2X16/90]
JP3  PINHD-2X8/90  [2X08/90]
JP4  PINHD-2X8/90  [2X08/90]
JP5  PINHD-2X8  [2X08]
JP6  PINHD-2X2/90  [2X02/90]
JP7  PINHD-2X2/90  [2X02/90]
JP8  PINHD-1X3  [1X03]
JP9  JP1Q  [JP1]
JP10  PINHD-2X8  [2X08]
JP11  PINHD-2X2  [2X02]
JP12  PINHD-2X2  [2X02]
JP13  PINHD-2X12_2.54-SMD  [2X12SMD]
LED1  LEDCHIP-LED0603  [CHIP-LED0603]
LED2  LEDCHIP-LED0603  [CHIP-LED0603]
LED3  LEDCHIP-LED0603  [CHIP-LED0603]
LED4  LEDCHIP-LED0603  [CHIP-LED0603]
LED5  LEDCHIP-LED0603  [CHIP-LED0603]
PL1  555X-24V  [5566-24]
Q1  BCF29SMD  [SOT23-BEC]
R1  68  R-EU_R0805  [R0805]
R3  68  R-EU_R0805  [R0805]
R5  220  R-EU_R0805  [R0805]
R10  680  R-EU_R0805  [R0805]
R11  330  R-EU_R0805  [R0805]
R12  1k  R-EU_R0805  [R0805]
S1  1MS1T1B1M2QES-5  [1MS1T1B1M2QES-5]
SV1  FE20-2  [FE20-2]
U2  AMP-5103309-7-34PIN_5103309-7  [AMP-5103309-7-34PIN_TYCO_5103309-7]
U$1  TEENSY41  [TEENSY41]
X1  22-23-2031  [22-23-2031]

### Nets
3_3V: SV1.17
+5V: C13.+ J49.1 J50.1 J51.1 J52.1 J53.1 J54.1 J55.1 J56.1 J57.1 J58.1 J59.1 J60.1 J61.1 J62.1 J63.1 J64.1 JP6.1 JP6.2 JP6.3 JP6.4 JP7.1 JP7.2 JP7.3 JP7.4 JP9.2 JP11.2 JP11.4 JP12.2 JP12.4 PL1.23 R5.2 ; also sheet 1,3
+5V_CURR_LIM: LED2.A R5.1
ADC2_0: J32.3 JP4.1 ; also sheet 1
ADC2_1: J31.3 JP4.3 ; also sheet 1
ADC2_2: J30.3 JP4.5 ; also sheet 1
ADC2_3: J29.3 JP4.7 ; also sheet 1
ADC2_4: J28.3 JP4.9 ; also sheet 1
ADC2_5: J27.3 JP4.11 ; also sheet 1
ADC2_6: J26.3 JP4.13 ; also sheet 1
ADC2_7: J25.3 JP4.15 ; also sheet 1
ADC2_8: J17.3 JP3.15 ; also sheet 1
ADC2_9: J18.3 JP3.13 ; also sheet 1
ADC2_10: J19.3 JP3.11 ; also sheet 1
ADC2_11: J20.3 JP3.9 ; also sheet 1
ADC2_12: J21.3 JP3.7 ; also sheet 1
ADC2_13: J22.3 JP3.5 ; also sheet 1
ADC2_14: J23.3 JP3.3 ; also sheet 1
ADC2_15: J24.3 JP3.1 ; also sheet 1
ADC_2_CONVST: SV1.5 U$1.2-OUT2 ; also sheet 1
BT_1_AIN1_+: J49.3 JP10.2 ; also sheet 3
BT_1_AIN1_-: J49.4 JP10.1 ; also sheet 3
BT_1_AIN2_+: J50.3 JP10.4 ; also sheet 3
BT_1_AIN2_-: J50.4 JP10.3 ; also sheet 3
BT_2_AIN1_+: J51.3 JP10.6 ; also sheet 3
BT_2_AIN1_-: J51.4 JP10.5 ; also sheet 3
BT_2_AIN2_+: J52.3 JP10.8 ; also sheet 3
BT_2_AIN2_-: J52.4 JP10.7 ; also sheet 3
BT_3_AIN1_+: J53.3 JP10.10 ; also sheet 3
BT_3_AIN1_-: J53.4 JP10.9 ; also sheet 3
BT_3_AIN2_+: J54.3 JP10.12 ; also sheet 3
BT_3_AIN2_-: J54.4 JP10.11 ; also sheet 3
BT_4_AIN1_+: J55.3 JP10.14 ; also sheet 3
BT_4_AIN1_-: J55.4 JP10.13 ; also sheet 3
BT_4_AIN2_+: J56.3 JP10.16 ; also sheet 3
BT_4_AIN2_-: J56.4 JP10.15 ; also sheet 3
BT_5_AIN1_+: J57.3 JP5.2 ; also sheet 3
BT_5_AIN1_-: J57.4 JP5.1 ; also sheet 3
BT_5_AIN2_+: J58.3 JP5.4 ; also sheet 3
BT_5_AIN2_-: J58.4 JP5.3 ; also sheet 3
BT_6_AIN1_+: J59.3 JP5.6 ; also sheet 3
BT_6_AIN1_-: J59.4 JP5.5 ; also sheet 3
BT_6_AIN2_+: J60.3 JP5.8 ; also sheet 3
BT_6_AIN2_-: J60.4 JP5.7 ; also sheet 3
BT_7_AIN1_+: J61.3 JP5.10 ; also sheet 3
BT_7_AIN1_-: J61.4 JP5.9 ; also sheet 3
BT_7_AIN2_+: J62.3 JP5.12 ; also sheet 3
BT_7_AIN2_-: J62.4 JP5.11 ; also sheet 3
BT_8_AIN1_+: J63.3 JP5.14 ; also sheet 3
BT_8_AIN1_-: J63.4 JP5.13 ; also sheet 3
BT_8_AIN2_+: J64.3 JP5.16 ; also sheet 3
BT_8_AIN2_-: J64.4 JP5.15 ; also sheet 3
D_IO_1: JP13.2 U$1.7-RX2/OUT1A
D_IO_2: JP13.4 U$1.8-TX2/IN2(8-TX2/IN1)
D_IO_3: JP13.6 U$1.9-OUT1C
D_IO_4: JP13.8 U$1.10-CS\MQSR(10-CS/MQSR)
D_IO_5: JP13.10 U$1.25-A11/RX6/SDA2
D_IO_6: JP13.12 U$1.26-A12/MOSI1
D_IO_7: JP13.14 U$1.27-A13/SCK1
D_IO_8: JP13.16 U$1.28-RX7
D_IO_9: JP13.18 U$1.29-TX7
D_IO_10: JP13.20 U$1.30-CRX3
D_IO_11: JP13.22 U$1.31-CTX3
D_IO_12: JP13.24 U$1.32-OUT1B
DAC2_0: JP2.15 U2.15 ; also sheet 2
DAC2_1: JP2.13 U2.13 ; also sheet 2
DAC2_2: JP2.11 U2.11 ; also sheet 2
DAC2_3: JP2.9 U2.9 ; also sheet 2
DAC2_4: JP2.7 U2.7 ; also sheet 2
DAC2_5: JP2.5 U2.5 ; also sheet 2
DAC2_6: JP2.3 U2.3 ; also sheet 2
DAC2_7: JP2.1 U2.1 ; also sheet 2
DAC2_8: JP2.31 U2.31 ; also sheet 2
DAC2_9: JP2.29 U2.29 ; also sheet 2
DAC2_10: JP2.27 U2.27 ; also sheet 2
DAC2_11: JP2.25 U2.25 ; also sheet 2
DAC2_12: JP2.23 U2.23 ; also sheet 2
DAC2_13: JP2.21 U2.21 ; also sheet 2
DAC2_14: JP2.19 U2.19 ; also sheet 2
DAC2_15: JP2.17 U2.17 ; also sheet 2
DVCC: C14.+ PL1.2 Q1.C R3.2 ; also sheet 1,2,3
DVCC_CURR_LIM: LED3.A R3.1
GND: C8.- C12.- C13.- C14.- C15.- C16.+ J17.2 J18.2 J19.2 J20.2 J21.2 J22.2 J23.2 J24.2 J25.2 J26.2 J27.2 J28.2 J29.2 J30.2 J31.2 J32.2 J49.2 J50.2 J51.2 J52.2 J53.2 J54.2 J55.2 J56.2 J57.2 J58.2 J59.2 J60.2 J61.2 J62.2 J63.2 J64.2 JP2.2 JP2.4 JP2.6 JP2.8 JP2.10 JP2.12 JP2.14 JP2.16 JP2.18 JP2.20 JP2.22 JP2.24 JP2.26 JP2.28 JP2.30 JP2.32 JP3.2 JP3.4 JP3.6 JP3.8 JP3.10 JP3.12 JP3.14 JP3.16 JP4.2 JP4.4 JP4.6 JP4.8 JP4.10 JP4.12 JP4.14 JP4.16 JP8.3 JP11.1 JP11.3 JP12.1 JP12.3 JP13.1 JP13.3 JP13.5 JP13.7 JP13.9 JP13.11 JP13.13 JP13.15 JP13.17 JP13.19 JP13.21 JP13.23 LED1.C LED2.C LED3.C LED4.C LED5.C PL1.3 PL1.5 PL1.7 PL1.15 PL1.17 PL1.18 PL1.19 PL1.24 S1.3 SV1.6 SV1.9 SV1.14 SV1.20 SV1.25 SV1.30 SV1.34 SV1.39 U2.2 U2.4 U2.6 U2.8 U2.10 U2.12 U2.14 U2.16 U2.18 U2.20 U2.22 U2.24 U2.26 U2.28 U2.30 U2.32 U$1.GND1 U$1.GND3 U$1.GND6 X1.3 ; also sheet 1,2,3
HB_CURR_LIM: LED1.A R11.1
HEARTBEAT: R11.2 SV1.3 U$1.6-OUT1D
LC_1_CS0: SV1.29 U$1.41-A17/MISO1 ; also sheet 3
LC_1_CS1: SV1.26 U$1.14-A0/TX3/SPDIF_OUT ; also sheet 3
LC_1_CS2: SV1.24 U$1.15-A1/RX3/SPDIF_IN ; also sheet 3
LC_1_CS3: SV1.22 U$1.16-A2/RX4/SCL1 ; also sheet 3
LC_1_CS4: SV1.40 U$1.33-MCLK2 ; also sheet 3
LC_1_CS5: SV1.38 U$1.34-RX8 ; also sheet 3
LC_1_CS6: SV1.37 U$1.35-TX8(35/TX8) ; also sheet 3
LC_1_CS7: SV1.36 U$1.36-PWM ; also sheet 3
LC_1_RDY0: SV1.13 U$1.20-A6/TX5/LRCLK1 ; also sheet 3
LC_1_RDY1: SV1.15 U$1.19-A5/SCL0 ; also sheet 3
LC_1_RDY2: SV1.16 U$1.18-A4/SDA0 ; also sheet 3
LC_1_RDY3: SV1.18 U$1.17-A3/TX4/SDA1 ; also sheet 3
LC_1_RDY4: SV1.31 U$1.40-A16/CS1 ; also sheet 3
LC_1_RDY5: SV1.32 U$1.39-A15/CS/OUT1A ; also sheet 3
LC_1_RDY6: SV1.33 U$1.38-A14/CS/IN1 ; also sheet 3
LC_1_RDY7: SV1.35 U$1.37-PWM ; also sheet 3
LDAC: SV1.11 U$1.4-BCLK2 ; also sheet 2
MISO: SV1.21 U$1.12-MISO/MQSL ; also sheet 1,2,3
MOSI: SV1.19 U$1.11-MOSI/CTX1 ; also sheet 1,2,3
N$12: SV1.28
N$13: SV1.27
PG_CURR_LIM: LED4.A R1.1
PG_SIG: Q1.B R12.1
POWER_GOOD: PL1.8 R12.2
POWER_GOOD_SUPP: Q1.E R1.2
PSU_ENABLE: PL1.16 S1.2
PWR: C15.+ JP9.1 SV1.2 SV1.4 U$1.VIN
RX: JP8.2 SV1.10 U$1.0-RX1/CS1/CRX2
SCLK: SV1.23 U$1.13-SCK/LED ; also sheet 1,2,3
SS_ADC_2: SV1.7 U$1.3-LRCLK2 ; also sheet 1
SS_DAC_2: SV1.12 U$1.5-IN2 ; also sheet 2
TX: JP8.1 SV1.8 U$1.1-TX1/MISO1/CTX2
VDD: C8.+ C12.+ J17.1 J18.1 J19.1 J20.1 J21.1 J22.1 J23.1 J24.1 J25.1 J26.1 J27.1 J28.1 J29.1 J30.1 J31.1 J32.1 PL1.11 R10.2 X1.2 ; also sheet 1,2
VDD_CURR_LIM: LED5.A R10.1
VSS: C16.- PL1.14 ; also sheet 2
Unconnected: PL1.1 PL1.4 PL1.6 PL1.9 PL1.10 PL1.12 PL1.13 PL1.20 PL1.21 PL1.22 S1.1 SV1.1 U2.33 U2.34 U$1.3V3-1 U$1.3V3-2 U$1.3V3-3 U$1.21-A7/RX5/BCLK1 U$1.22-A8/CTX1 U$1.23-A9/CRX1/MCLK1 U$1.24-A10/TX6/SCL2 U$1.+5V(5V) U$1.D+ U$1.D- U$1.DM U$1.DP U$1.G U$1.GND2 U$1.GND4 U$1.GND5 U$1.LED U$1.ON/OFF U$1.PROGRAM U$1.R+ U$1.R- U$1.T+ U$1.T- U$1.VBAT U$1.VUSB X1.1

## Library data of the parts
C1-C7 C11 C19 C20 C32 C33 C35 C36 C38-C51 C62 C136 C137 C141 C143 C145 C147 C148 C150 C151 = rcl:C-EU: CAPACITOR, European symbol
C8 C12-C16 = rcl:CPOL-EU: POLARIZED CAPACITOR, European symbol; SPICEPREFIX: C
C9 C10 C21-C28 = resistor:CPOL-EU: POLARIZED CAPACITOR, European symbol
J17-J32 = RPi_Extension_contr_sens_conn_board:JST_PH_B3B-PH-K-S(LF)(SN): PH-2.0mm Header top entry 3 way JST PH Series, Series Number B3B, 2mm Pitch 3 Way 1 Row Straight PCB Header, Through Hole Termination, 2A <https://componentsearchengine.com/Images/3/B3B-PH-K-S%28LF%29%28SN%29.jpg> Source: Datasheet <http://uk.rs-online.com/web/p/products/8201431>; DESCRIPTION: PH-2.0mm Header top entry 3 way JST PH Series, Series Number B3B, 2mm Pitch 3 Way 1 Row Straight PCB Header, Through Hole Termination, 2A; HEIGHT: 6mm; MANUFACTURER_NAME: JST (JAPAN SOLDERLESS TERMINALS); MANUFACTURER_PART_NUMBER: B3B-PH-K-S(LF)(SN); RS_PART_NUMBER: 8201431P; SUPPLIER_NAME: RS
J49-J64 = B4B-PH-K-S(LF)(SN):B4B-PH-K-S(LF)(SN): PH-2.0mm Header top entry 4 way JST PH Series, Series Number B4B, 2mm Pitch 4 Way 1 Row Straight PCB Header, Through Hole Termination, 2A <https://componentsearchengine.com/Images/3/B4B-PH-K-S%28LF%29%28SN%29.jpg> Source: Datasheet <http://docs-europe.electrocomponents.com/webdocs/1347/0900766b81347511.pdf>; DESCRIPTION: PH-2.0mm Header top entry 4 way JST PH Series, Series Number B4B, 2mm Pitch 4 Way 1 Row Straight PCB Header, Through Hole Termination, 2A; HEIGHT: 6mm; MANUFACTURER_NAME: JST (JAPAN SOLDERLESS TERMINALS); MANUFACTURER_PART_NUMBER: B4B-PH-K-S(LF)(SN); RS_PART_NUMBER: 8201434P; SUPPLIER_NAME: RS
JP2 = pinhead:PINHD-2X16: PIN HEADER
JP3-JP5 JP10 = pinhead:PINHD-2X8: PIN HEADER
JP6 JP7 JP11 JP12 = pinhead:PINHD-2X2: PIN HEADER
JP8 = pinhead:PINHD-1X3: PIN HEADER
JP9 = jumper:JP1Q: JUMPER
JP13 = pinhead-2:PINHD-2X12: PIN HEADER
LED1-LED5 = led:LED: LED OSRAM: - CHIPLED LG R971, LG N971, LY N971, LG Q971, LY Q971, LO R971, LY R971 LH N974, LH R974 LS Q976, LO Q976, LY Q976 LO Q996 - Hyper CHIPLED LW Q18S LB Q993, LB Q99A, LB R99A - SideLED LS A670, LO A670, LY A670, LG A670, LP A670 LB A673, LV A673, LT A673, LW A673 LH A674 LY A675 LS A676, LA A676, LO A676, LY A676, LW A676 LS A679, LY A679, LG A679 - Hyper Micro SIDELED® LS Y876, LA Y876, LO Y876, LY Y876 LT Y87S - SmartLED LW L88C, LW L88S LB L89C, LB L89S, LG L890 LS L89K, LO L89K, LY L89K LS L896, LA L896, LO L896, LY L896 - TOPLED LS T670, LO T670, LY T670, LG T670, LP T670 LSG T670, LSP T670, LSY T670, LOP T670, LYG T670 LG T671, LOG T671, LSG T671 LB T673, LV T673, LT T673, LW T673 LH T674 LS T676, LA T676, LO T676, LY T676, LB T676, LH T676, LSB T676, LW T676 LB T67C, LV T67C, LT T67C, LS T67K, LO T67K, LY T67K, LW E67C LS E67B, LA E67B, LO E67B, LY E67B, LB E67C, LV E67C, LT E67C LW T67C LS T679, LY T679, LG T679 LS T770, LO T770, LY T770, LG T770, LP T770 LB T773, LV T773, LT T773, LW T773 LH T774 LS E675, LA E675, LY E675, LS T675 LS T776, LA T776, LO T776, LY T776, LB T776 LHGB T686 LT T68C, LB T68C - Hyper Mini TOPLED® LB M676 - Mini TOPLED Santana® LG M470 LS M47K, LO M47K, LY M47K Source: http://www.osram.convergy.de LUXEON: - LUMILED® LXK2-PW12-R00, LXK2-PW12-S00, LXK2-PW14-U00, LXK2-PW14-V00 LXK2-PM12-R00, LXK2-PM12-S00, LXK2-PM14-U00 LXK2-PE12-Q00, LXK2-PE12-R00, LXK2-PE12-S00, LXK2-PE14-T00, LXK2-PE14-U00 LXK2-PB12-K00, LXK2-PB12-L00, LXK2-PB12-M00, LXK2-PB14-N00, LXK2-PB14-P00, LXK2-PB14-Q00 LXK2-PR12-L00, LXK2-PR12-M00, LXK2-PR14-Q00, LXK2-PR14-R00 LXK2-PD12-Q00, LXK2-PD12-R00, LXK2-PD12-S00 LXK2-PH12-R00, LXK2-PH12-S00 LXK2-PL12-P00, LXK2-PL12-Q00, LXK2-PL12-R00 Source: www.luxeon.com KINGBRIGHT: KA-3528ASYC Source: www.kingbright.com
PL1 = con-molex-2:555X-24: Mini FIT connector 24 way
Q1 = transistor-npn:BCF29*: NPN Transistor
R1-R6 R10-R12 R19 R20 = resistor:R-EU_: RESISTOR, European symbol
S1 = 1MS1T1B1M2QES-5:1MS1T1B1M2QES-5: Toggle switch,SP,on-none-on,PC thru-hole Toggle Switch SPDT On-On, 5 A @ 250 V ac, PCB <https://componentsearchengine.com/Images/3/1MS1T1B1M2QES-5.jpg> Source: Datasheet <http://uk.rs-online.com/web/p/products/7347066>; DESCRIPTION: Toggle switch,SP,on-none-on,PC thru-hole Toggle Switch SPDT On-On, 5 A @ 250 V ac, PCB; HEIGHT: mm; MANUFACTURER_NAME: RS Components; MANUFACTURER_PART_NUMBER: 1MS1T1B1M2QES-5; RS_PART_NUMBER: 7347066P; SUPPLIER_NAME: RS
S2 S8 = switch-omron:10-XX: OMRON SWITCH; MPN: B3F-1000; OC_FARNELL: 176432; OC_NEWARK: 36M3542
SV1 = con-lsta:FE20-2: FEMALE HEADER; OC_FARNELL: unknown; OC_NEWARK: unknown
U2 = RPi_Extension_contr_sens_conn_board:AMP-5103309-7-34PIN_5103309-7: WIRE-BOARD CONN, HEADER, 34POS; MPN: 5103309-7; OC_FARNELL: 1425170; OC_NEWARK: 02M6713; PACKAGE: 34 WAY HEADER; SUPPLIER: TycoElectronics
U4 U20 = ADR423ARZ:ADR423ARZ; MANUFACTURER_PART_NUMBER: ADR423ARZ; VENDOR: Vendor
U5 = AD7616BSTZ:AD7616BSTZ
U18 U21 U23-U28 = AD7730BRUZ:AD7730BRUZ
U19 = AD5360BSTZ:AD5360BSTZ
U$1 = teensy:TEENSY41
X1 = con-molex:22-23-2031: .100" (2.54mm) Center Header - 3 Pin; MF: MOLEX; MPN: 22-23-2031; OC_FARNELL: 1462950; OC_NEWARK: 30C0862
Y1 Y3 = kc2520b_c1:KC2520B-C1